# Altium schematic sheet motor.SchDoc
size A3
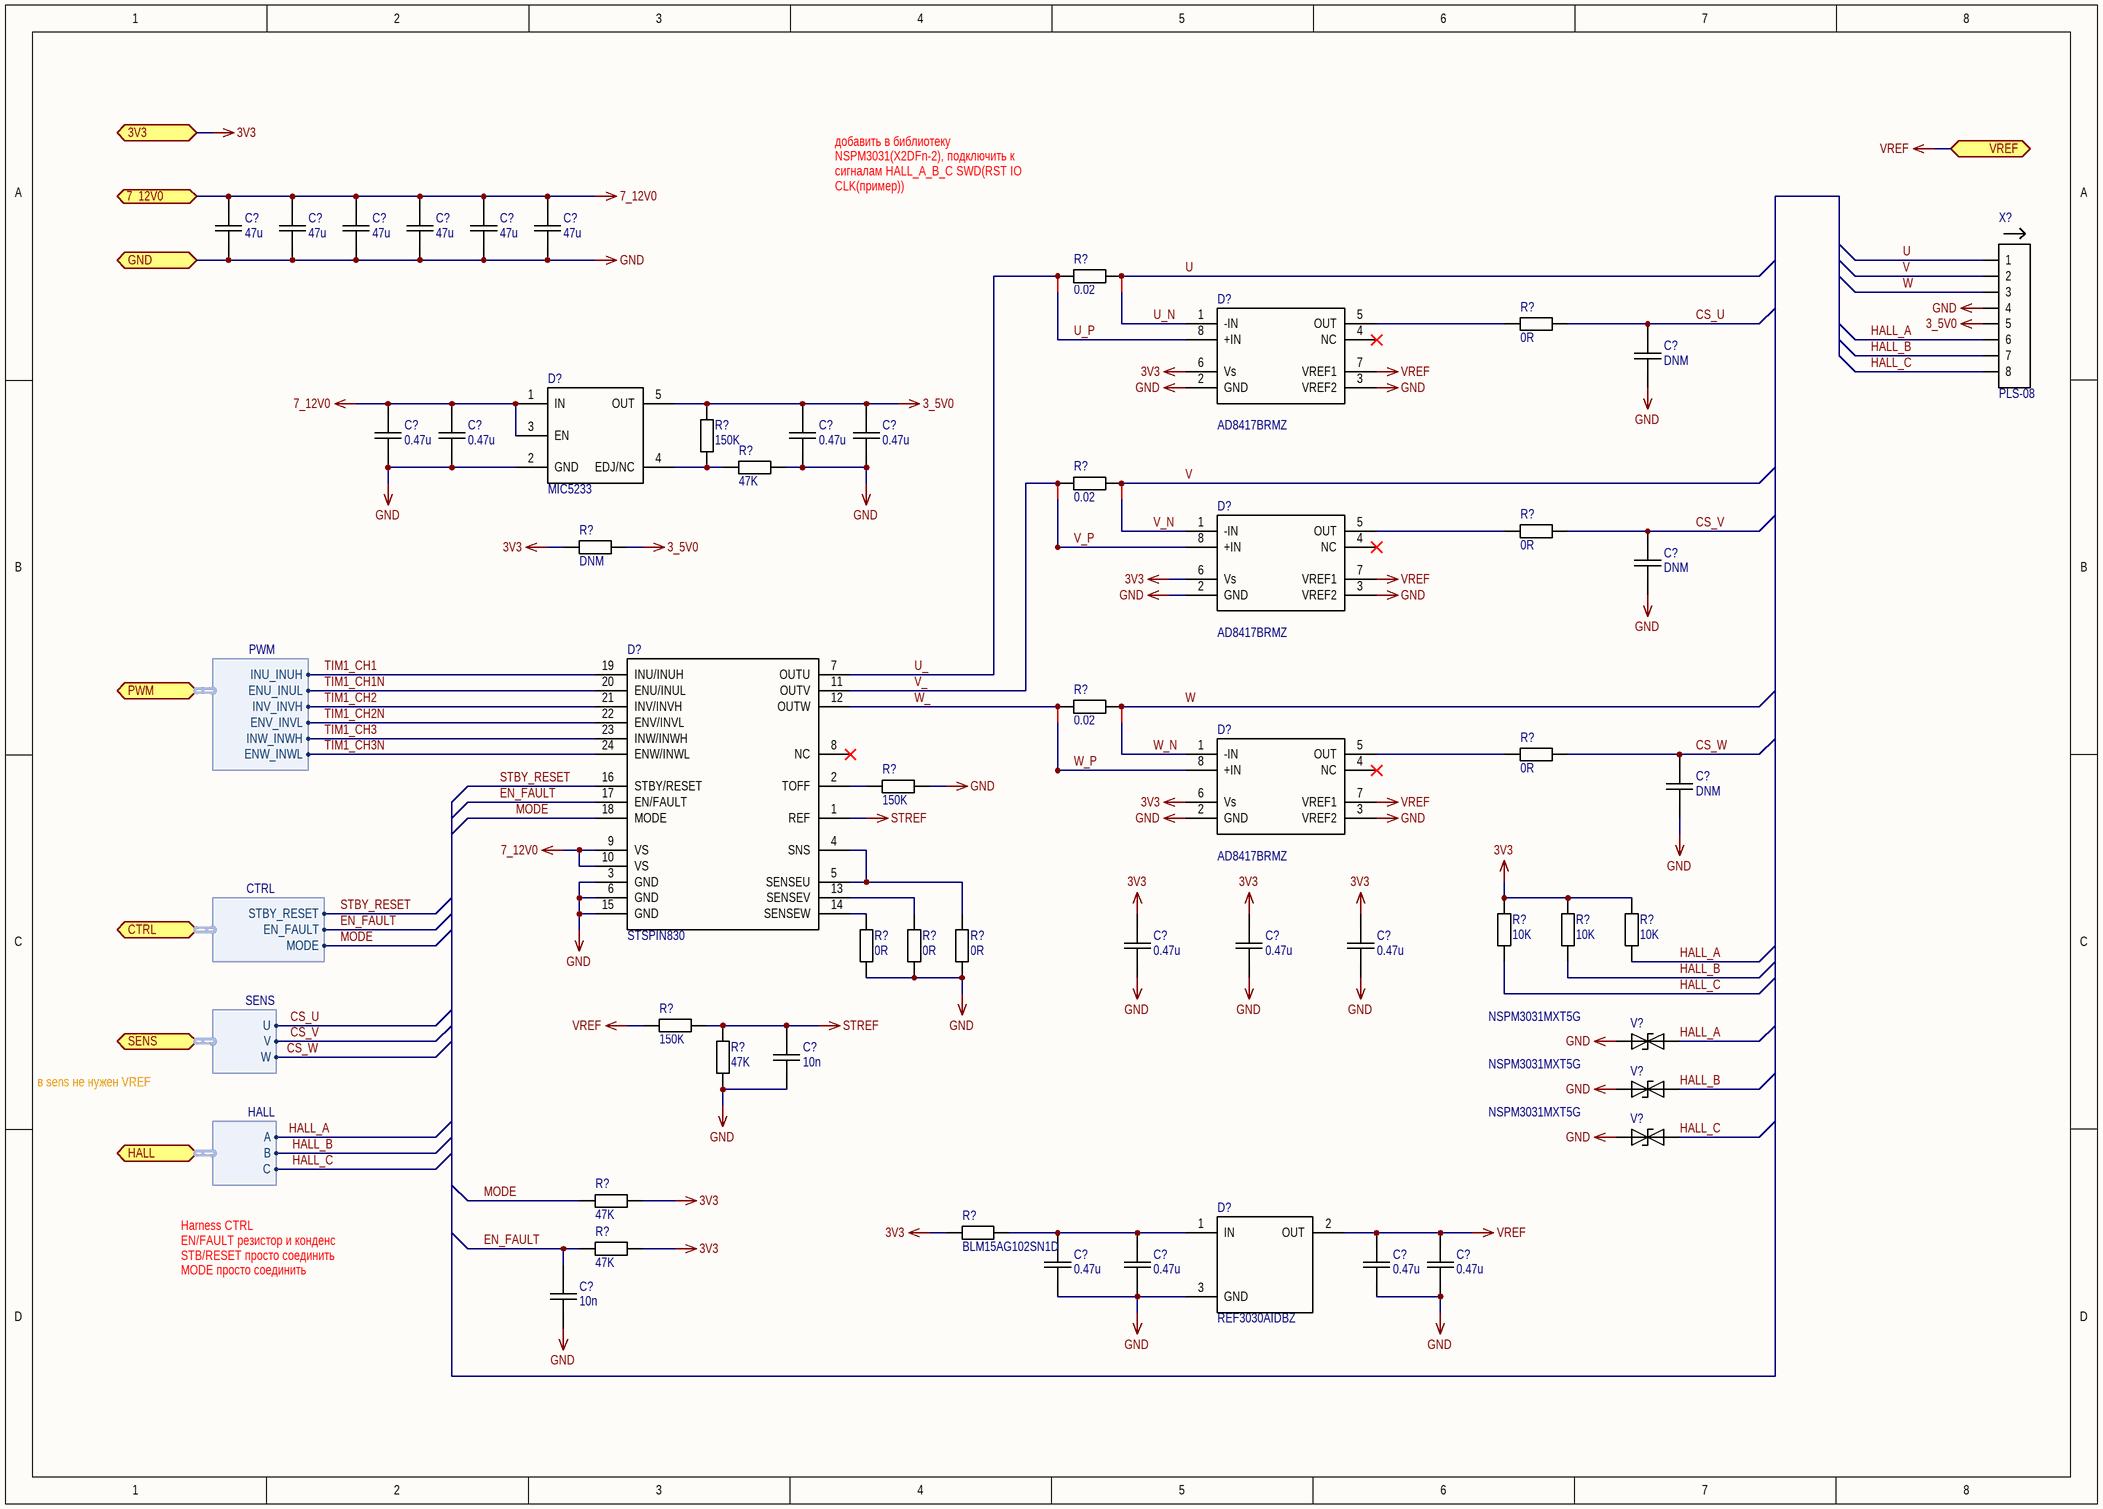
[diagram p0: motor.SchDoc]

## Parts
(Parts that share a designator on the sheet are numbered #1, #2 ... from top to bottom, then left to right.)
C?#1  value 47u  [CAP-1206]  (hidden comment: CAP-47u-20%-25V-X7R-1206)
C?#2  value 47u  [CAP-1206]  (hidden comment: CAP-47u-20%-25V-X7R-1206)
C?#3  value 47u  [CAP-1206]  (hidden comment: CAP-47u-20%-25V-X7R-1206)
C?#4  value 47u  [CAP-1206]  (hidden comment: CAP-47u-20%-25V-X7R-1206)
C?#5  value 47u  [CAP-1206]  (hidden comment: CAP-47u-20%-25V-X7R-1206)
C?#6  value 47u  [CAP-1206]  (hidden comment: CAP-47u-20%-25V-X7R-1206)
C?#7  value DNM  [CAP-0402]  (hidden comment: CAP-DNM-10%-50V-X7R-0402)
C?#8  value 0.47u  [CAP-0402]  (hidden comment: CAP-0.47u-10%-50V-X7R-0402)
C?#9  value 0.47u  [CAP-0402]  (hidden comment: CAP-0.47u-10%-50V-X7R-0402)
C?#10  value 0.47u  [CAP-0402]  (hidden comment: CAP-0.47u-10%-50V-X7R-0402)
C?#11  value 0.47u  [CAP-0402]  (hidden comment: CAP-0.47u-10%-50V-X7R-0402)
C?#12  value DNM  [CAP-0402]  (hidden comment: CAP-DNM-10%-50V-X7R-0402)
C?#13  value DNM  [CAP-0402]  (hidden comment: CAP-DNM-10%-50V-X7R-0402)
C?#14  value 0.47u  [CAP-0402]  (hidden comment: CAP-0.47u-10%-50V-X7R-0402)
C?#15  value 0.47u  [CAP-0402]  (hidden comment: CAP-0.47u-10%-50V-X7R-0402)
C?#16  value 0.47u  [CAP-0402]  (hidden comment: CAP-0.47u-10%-50V-X7R-0402)
C?#17  value 10n  [CAP-0402]  (hidden comment: CAP-10n-10%-50V-X7R-0402)
C?#18  value 0.47u  [CAP-0402]  (hidden comment: CAP-0.47u-10%-50V-X7R-0402)
C?#19  value 0.47u  [CAP-0402]  (hidden comment: CAP-0.47u-10%-50V-X7R-0402)
C?#20  value 0.47u  [CAP-0402]  (hidden comment: CAP-0.47u-10%-50V-X7R-0402)
C?#21  value 0.47u  [CAP-0402]  (hidden comment: CAP-0.47u-10%-50V-X7R-0402)
C?#22  value 10n  [CAP-0402]  (hidden comment: CAP-10n-10%-50V-X7R-0402)
D?#1  AD8417BRMZ  [MSOP-8]
D?#2  MIC5233  [SOT-23-5]
D?#3  AD8417BRMZ  [MSOP-8]
D?#4  STSPIN830  [QFN-24-4X4]
D?#5  AD8417BRMZ  [MSOP-8]
D?#6  REF3030AIDBZ  [SOT-23-3]
NT?#1  Net_tie  [Net_tie]  (value not drawn)  (net tie, no BOM)
NT?#2  Net_tie  [Net_tie]  (value not drawn)  (net tie, no BOM)
NT?#3  Net_tie  [Net_tie]  (value not drawn)  (net tie, no BOM)
NT?#4  Net_tie  [Net_tie]  (value not drawn)  (net tie, no BOM)
NT?#5  Net_tie  [Net_tie]  (value not drawn)  (net tie, no BOM)
NT?#6  Net_tie  [Net_tie]  (value not drawn)  (net tie, no BOM)
R?#1  value 0.02  [RES-0402]  (hidden comment: RES-0.02-1%-0.063-0402)
R?#2  value 0R  [RES-0402]  (hidden comment: RES-0R-1%-0.063-0402)
R?#3  value 150K  [RES-0402]  (hidden comment: RES-150K-1%-0.063-0402)
R?#4  value 47K  [RES-0402]  (hidden comment: RES-47K-1%-0.063-0402)
R?#5  value 0.02  [RES-0402]  (hidden comment: RES-0.02-1%-0.063-0402)
R?#6  value 0R  [RES-0402]  (hidden comment: RES-0R-1%-0.063-0402)
R?#7  value DNM  [RES-0402]  (hidden comment: RES-DNM-1%-0.063-0402)
R?#8  value 0.02  [RES-0402]  (hidden comment: RES-0.02-1%-0.063-0402)
R?#9  value 0R  [RES-0402]  (hidden comment: RES-0R-1%-0.063-0402)
R?#10  value 150K  [RES-0402]  (hidden comment: RES-150K-1%-0.063-0402)
R?#11  value 10K  [RES-0402]  (hidden comment: RES-10K-1%-0.063-0402)
R?#12  value 10K  [RES-0402]  (hidden comment: RES-10K-1%-0.063-0402)
R?#13  value 10K  [RES-0402]  (hidden comment: RES-10K-1%-0.063-0402)
R?#14  value 0R  [RES-0402]  (hidden comment: RES-0R-1%-0.063-0402)
R?#15  value 0R  [RES-0402]  (hidden comment: RES-0R-1%-0.063-0402)
R?#16  value 0R  [RES-0402]  (hidden comment: RES-0R-1%-0.063-0402)
R?#17  value 150K  [RES-0402]  (hidden comment: RES-150K-1%-0.063-0402)
R?#18  value 47K  [RES-0402]  (hidden comment: RES-47K-1%-0.063-0402)
R?#19  value 47K  [RES-0402]  (hidden comment: RES-47K-1%-0.063-0402)
R?#20  BLM15AG102SN1D  [BLM15]
R?#21  value 47K  [RES-0402]  (hidden comment: RES-47K-1%-0.063-0402)
V?#1  NSPM3031MXT5G  [X2DFN-2]
V?#2  NSPM3031MXT5G  [X2DFN-2]
V?#3  NSPM3031MXT5G  [X2DFN-2]
X?  PLS-08  [PLS-08]

## Ports
3V3 (bidir), 7_12V0 (bidir), CTRL (bidir, harness CTRL), GND (bidir), HALL (bidir, harness HALL), PWM (bidir, harness PWM), SENS (bidir, harness SENS), VREF (bidir)

## Harnesses
SENS: U, V, W
HALL: A, B, C
PWM: INU_INUH, ENU_INUL, INV_INVH, ENV_INVL, INW_INWH, ENW_INWL
CTRL: STBY_RESET, EN_FAULT, MODE

## Nets
3_5V0: C?#10.2 C?#11.2 D?#2.5(OUT) R?#3.2 R?#7.1 X?.5
3V3: C?#14.2 C?#15.2 C?#16.2 D?#1.6(Vs) D?#3.6(Vs) D?#5.6(Vs) R?#7.2 R?#11.2 R?#12.2 R?#13.2 R?#19.2 R?#20.1 R?#21.2 ; port 3V3
7_12V0: C?#1.2 C?#2.2 C?#3.2 C?#4.2 C?#5.2 C?#6.2 C?#8.2 C?#9.2 D?#2.1(IN) D?#2.3(EN) D?#4.9(VS) D?#4.10(VS) ; port 7_12V0
GND: C?#1.1 C?#2.1 C?#3.1 C?#4.1 C?#5.1 C?#6.1 C?#7.1 C?#8.1 C?#9.1 C?#10.1 C?#11.1 C?#12.1 C?#13.1 C?#14.1 C?#15.1 C?#16.1 C?#17.1 C?#18.1 C?#19.1 C?#20.1 C?#21.1 C?#22.1 D?#1.2(GND) D?#1.3(VREF2) D?#2.2(GND) D?#3.2(GND) D?#3.3(VREF2) D?#4.3(GND) D?#4.6(GND) D?#4.15(GND) D?#5.2(GND) D?#5.3(VREF2) D?#6.3(GND) R?#4.2 R?#10.1 R?#14.1 R?#15.1 R?#16.1 R?#18.1 V?#1.1 V?#2.1 V?#3.1 X?.4 ; port GND
STREF: C?#17.2 D?#4.1(REF) R?#17.2 R?#18.2
VREF: C?#20.2 C?#21.2 D?#1.7(VREF1) D?#3.7(VREF1) D?#5.7(VREF1) D?#6.2(OUT) R?#17.1 ; port VREF
CS_U: C?#7.2 R?#2.2 ; port SENS.U
CS_V: C?#12.2 R?#6.2 ; port SENS.V
CS_W: C?#13.2 R?#9.2 ; port SENS.W
EN_FAULT: C?#22.2 D?#4.17(EN/FAULT) R?#21.1 ; port CTRL.EN_FAULT
HALL_A: R?#13.1 V?#1.2 X?.6 ; port HALL.A
HALL_B: R?#12.1 V?#2.2 X?.7 ; port HALL.B
HALL_C: R?#11.1 V?#3.2 X?.8 ; port HALL.C
MODE: D?#4.18(MODE) R?#19.1 ; port CTRL.MODE
STBY_RESET: D?#4.16(STBY/RESET) ; port CTRL.STBY_RESET
TIM1_CH1: D?#4.19(INU/INUH) ; port PWM.INU_INUH
TIM1_CH1N: D?#4.20(ENU/INUL) ; port PWM.ENU_INUL
TIM1_CH2: D?#4.21(INV/INVH) ; port PWM.INV_INVH
TIM1_CH2N: D?#4.22(ENV/INVL) ; port PWM.ENV_INVL
TIM1_CH3: D?#4.23(INW/INWH) ; port PWM.INW_INWH
TIM1_CH3N: D?#4.24(ENW/INWL) ; port PWM.ENW_INWL
U: NT?#2.2 R?#1.2 X?.1
U_: D?#4.7(OUTU) NT?#1.2 R?#1.1
U_N: D?#1.1(-IN) NT?#2.1
U_P: D?#1.8(+IN) NT?#1.1
V: NT?#4.2 R?#5.2 X?.2
V_: D?#4.11(OUTV) NT?#3.2 R?#5.1
V_N: D?#3.1(-IN) NT?#4.1
V_P: D?#3.8(+IN) NT?#3.1
W: NT?#6.2 R?#8.2 X?.3
W_: D?#4.12(OUTW) NT?#5.2 R?#8.1
W_N: D?#5.1(-IN) NT?#6.1
W_P: D?#5.8(+IN) NT?#5.1
NetC?#18_2: C?#18.2 C?#19.2 D?#6.1(IN) R?#20.2
NetD?#1_5: D?#1.5(OUT) R?#2.1
NetD?#2_4: D?#2.4(EDJ/NC) R?#3.1 R?#4.1
NetD?#3_5: D?#3.5(OUT) R?#6.1
NetD?#4_2: D?#4.2(TOFF) R?#10.2
NetD?#4_4: D?#4.4(SNS) D?#4.5(SENSEU) R?#16.2
NetD?#4_13: D?#4.13(SENSEV) R?#15.2
NetD?#4_14: D?#4.14(SENSEW) R?#14.2
NetD?#5_5: D?#5.5(OUT) R?#9.1

Not connected (* = marked no-connect by the designer): D?#1 4(NC)*; D?#3 4(NC)*; D?#4 8(NC)*; D?#5 4(NC)*

## Buses and harness runs
bus 

## Notes on the sheet
- добавить в библиотеку NSPM3031(X2DFn-2), подключить к сигналам HALL_A_B_C SWD(RST IO CLK(пример))
- в sens не нужен VREF
- Harness CTRL
  EN/FAULT резистор и конденс
  STB/RESET просто соединить
  MODE просто соединить

## Library data of the parts
C?#1-C?#6 = CAP-1206: Конденсатор; Tolerance: 20; Voltage: 25; Part Number: *; Manufacturer: *; Temperature: X7R
C?#7-C?#22 = CAP-0402: Конденсатор; Tolerance: 10; Voltage: 50; Part Number: *; Manufacturer: *; Temperature: X7R
D?#1 D?#3 D?#5 = AD8417BRMZ: Интегральная микросхема; Manufacturer: TI; Part Number: AD8417BRMZ
D?#2 = MIC5233: Интегральная микросхема; Manufacturer: Microchip; Part Number: MIC5233
D?#4 = STSPIN830: Интегральная микросхема; Manufacturer: SiLabs; Part Number: STSPIN830
D?#6 = REF3030: Интегральная микросхема; Manufacturer: TI; Part Number: REF3030AIDBZ
NT?#1-NT?#6 = Net_tie: Короткое замыкание
R?#1-R?#19 R?#21 = RES-0402: Резистор; Tolerance: 1; Power: 0.063; Part Number: *; Manufacturer: *
R?#20 = BLM15AG102: Феррит; Manufacturer: *; Part Number: BLM15AG102SN1D
V?#1-V?#3 = NSPM3031: Диод подавления ESD; Manufacturer: *; Tolerance: *; Power: *; Part Number: NSPM3031MXT5G
X? = PLS-08: Manufacturer: *; Part Number: PLS-08